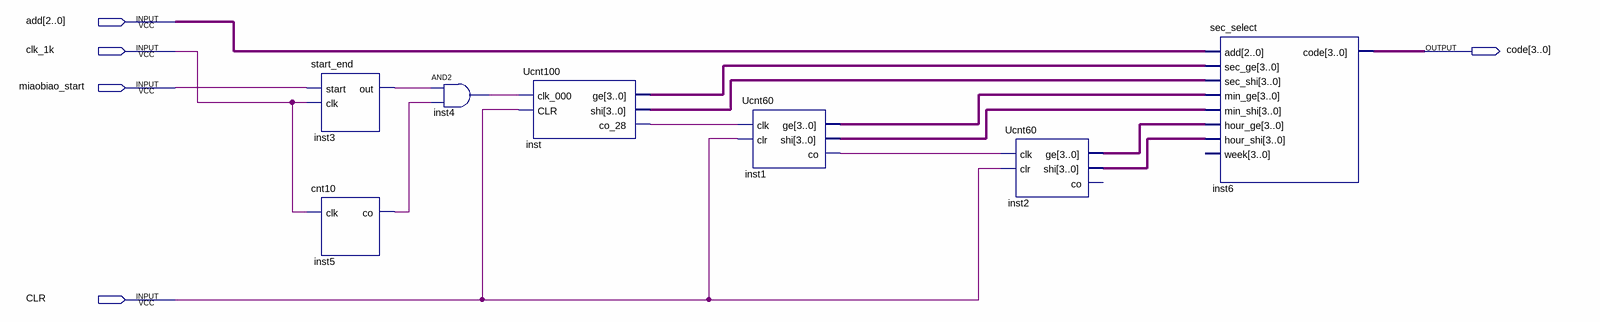
[diagram p0: schematic sheet]
// Quartus schematic miaobiao.bdf as structural Verilog: 7 symbols, 5 pins
module miaobiao (
  input  [2:0] add,
  input  clk_1k,
  input  miaobiao_start,
  input  CLR,
  output [3:0] code
);

  wire inst1_co, inst3_out, inst4_out, inst5_co, inst_co_28;
  wire [3:0] inst1_ge, inst1_shi, inst2_ge, inst2_shi, inst_ge, inst_shi;

  start_end inst3 (.start(miaobiao_start), .clk(clk_1k), .out(inst3_out));
  cnt10 inst5 (.clk(clk_1k), .co(inst5_co));
  and inst4 (inst4_out, inst3_out, inst5_co);
  Ucnt100 inst (.clk_000(inst4_out), .CLR(CLR), .ge(inst_ge), .shi(inst_shi), .co_28(inst_co_28));
  Ucnt60 inst1 (.clk(inst_co_28), .clr(CLR), .ge(inst1_ge), .shi(inst1_shi), .co(inst1_co));
  Ucnt60 inst2 (.clk(inst1_co), .clr(CLR), .ge(inst2_ge), .shi(inst2_shi));  // open: co
  sec_select inst6 (
    .add(add), .sec_ge(inst_ge), .sec_shi(inst_shi), .min_ge(inst1_ge), .min_shi(inst1_shi),
    .hour_ge(inst2_ge), .hour_shi(inst2_shi), .code(code));  // open: week
endmodule
